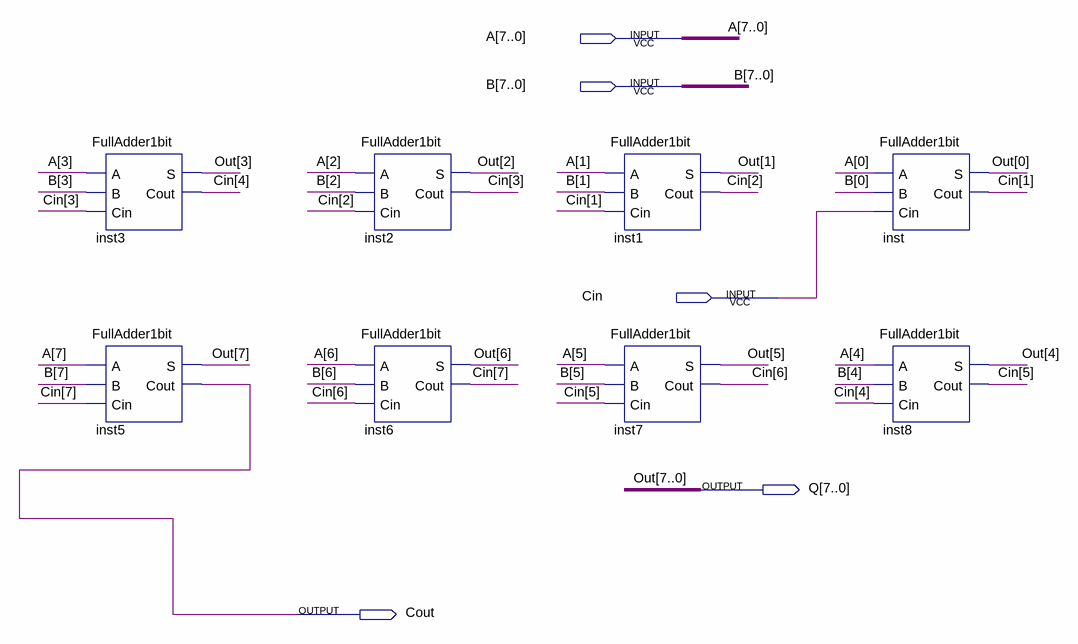
[diagram p0: schematic sheet]
// Quartus schematic FullAdder8bits.bdf as structural Verilog: 8 symbols, 5 pins
module FullAdder8bits (
  input  [7:0] A,
  input  [7:0] B,
  input  Cin,
  output [7:0] Q,
  output Cout
);

  wire [7:1] Cin_bus;

  FullAdder1bit inst3 (.A(A[3]), .B(B[3]), .Cin(Cin_bus[3]), .S(Q[3]), .Cout(Cin_bus[4]));
  FullAdder1bit inst5 (.A(A[7]), .B(B[7]), .Cin(Cin_bus[7]), .S(Q[7]), .Cout(Cout));
  FullAdder1bit inst2 (.A(A[2]), .B(B[2]), .Cin(Cin_bus[2]), .S(Q[2]), .Cout(Cin_bus[3]));
  FullAdder1bit inst6 (.A(A[6]), .B(B[6]), .Cin(Cin_bus[6]), .S(Q[6]), .Cout(Cin_bus[7]));
  FullAdder1bit inst1 (.A(A[1]), .B(B[1]), .Cin(Cin_bus[1]), .S(Q[1]), .Cout(Cin_bus[2]));
  FullAdder1bit inst7 (.A(A[5]), .B(B[5]), .Cin(Cin_bus[5]), .S(Q[5]), .Cout(Cin_bus[6]));
  FullAdder1bit inst (.A(A[0]), .B(B[0]), .Cin(Cin), .S(Q[0]), .Cout(Cin_bus[1]));
  FullAdder1bit inst8 (.A(A[4]), .B(B[4]), .Cin(Cin_bus[4]), .S(Q[4]), .Cout(Cin_bus[5]));

  // Other names for the same wires on the sheet: Out[7:0] = Q
endmodule
